# EAGLE design lvc-sampler (EAGLE 9.4.1)
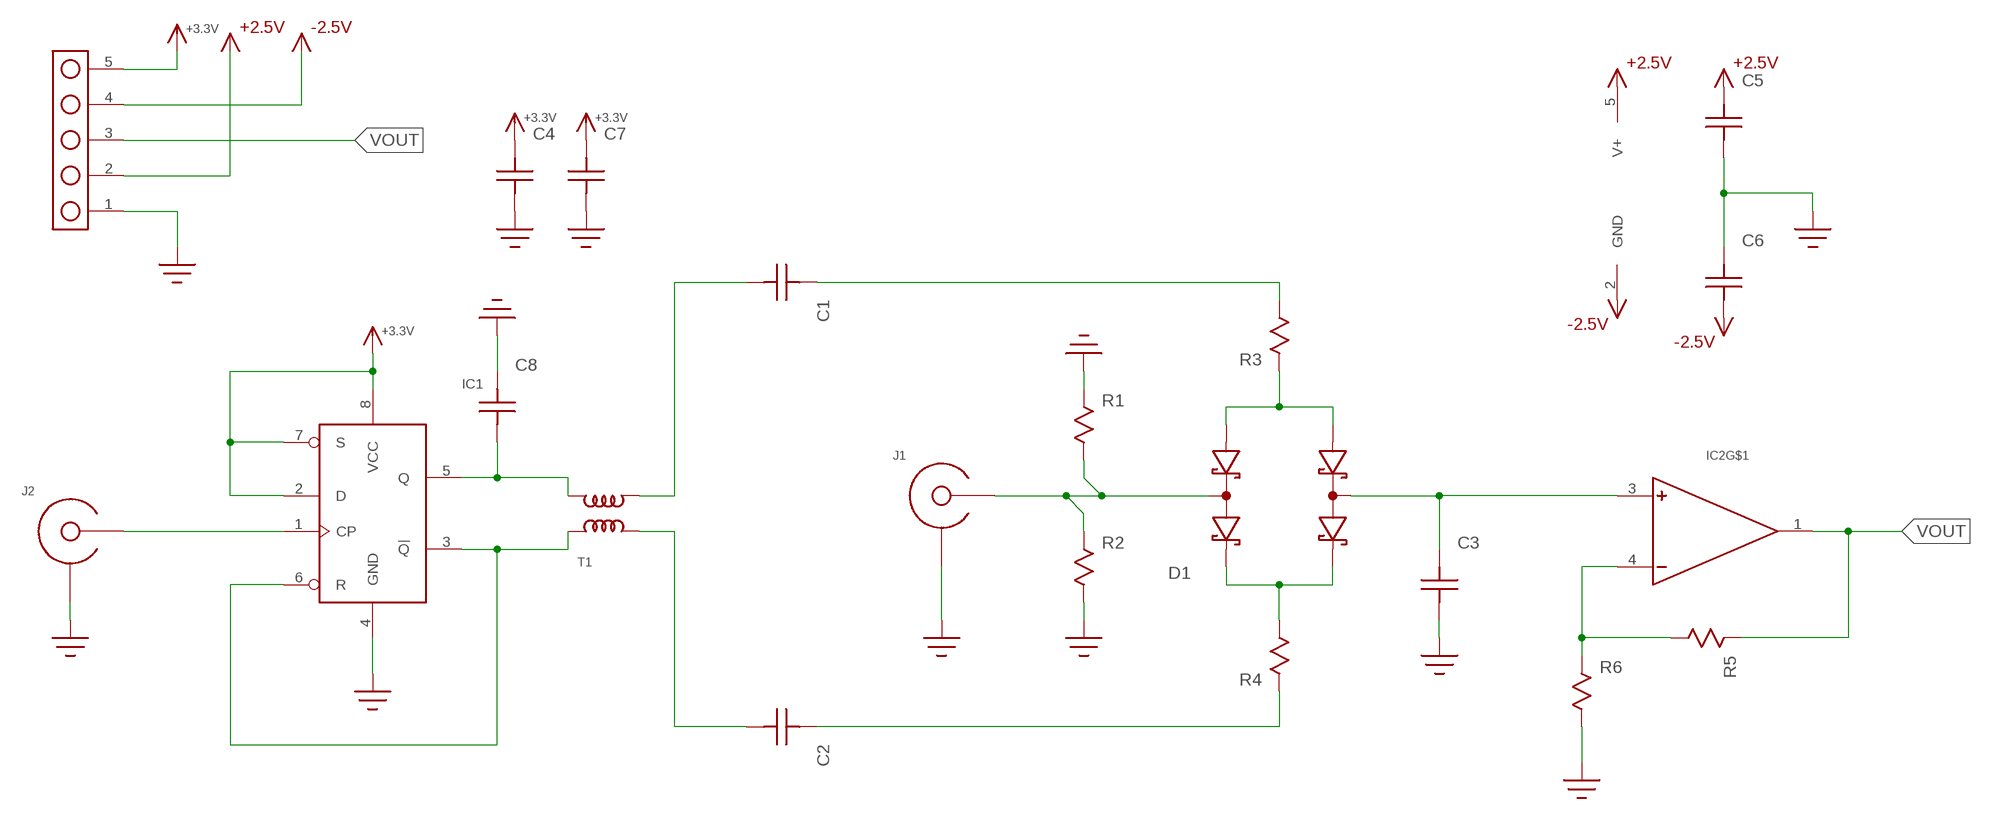
[diagram p0: schematic, sheet 1]

## Parts
C1  C0603  [C0603]
C2  C0603  [C0603]
C3  C0603  [C0603]
C4  C0603  [C0603]
C5  C0603  [C0603]
C6  C0603  [C0603]
C7  C0603  [C0603]
C8  C0603  [C0603]
D1  SMS3923-081  [SC-88]
IC1  74LVC2G74  [SSOP8]
IC2  MCP601  [SOT23-5]
J1  SMA-EDGE-LAUNCH4020_TAPER  [SMA_EDGE_LAUNCH_2L_4020_TAPER]
J2  SMA-EDGE-LAUNCH4020_TAPER  [SMA_EDGE_LAUNCH_2L_4020_TAPER]
J3  HEADER_5PIN  [HEADER_5PIN]
R1  R0603  [R0603]
R2  R0603  [R0603]
R3  R0603  [R0603]
R4  R0603  [R0603]
R5  R0603  [R0603]
R6  R0603  [R0603]
T1  MABA007159  [MABAES0061]

## Nets
+2.5V: C5.P$2 IC2.5(V+) J3.2
+3.3V: C4.P$2 C7.P$2 IC1.2(D) IC1.7(S) IC1.8(VCC) J3.5
-2.5V: C6.P$1 IC2.2(GND) J3.4
GND: C3.P$1 C4.P$1 C5.P$1 C6.P$2 C7.P$1 C8.P$2 IC1.4(GND) J1.BOTTOM_GND(SHIELD) J1.GND@1(SHIELD) J1.GND@2(SHIELD) J1.GND@3(SHIELD) J1.GND@4(SHIELD) J1.GND@5(SHIELD) J1.GND@6(SHIELD) J1.GND@7(SHIELD) J1.GND@8(SHIELD) J1.GND@14(SHIELD) J1.GND@15(SHIELD) J1.GND@16(SHIELD) J1.GND@17(SHIELD) J1.GND_PAD1(SHIELD) J1.GND_PAD2(SHIELD) J1.P$1(SHIELD) J1.P$2(SHIELD) J2.BOTTOM_GND(SHIELD) J2.GND@1(SHIELD) J2.GND@2(SHIELD) J2.GND@3(SHIELD) J2.GND@4(SHIELD) J2.GND@5(SHIELD) J2.GND@6(SHIELD) J2.GND@7(SHIELD) J2.GND@8(SHIELD) J2.GND@14(SHIELD) J2.GND@15(SHIELD) J2.GND@16(SHIELD) J2.GND@17(SHIELD) J2.GND_PAD1(SHIELD) J2.GND_PAD2(SHIELD) J2.P$1(SHIELD) J2.P$2(SHIELD) J3.1 R1.P$1 R2.P$2 R6.P$2
N$1: IC1.3(!Q!) IC1.6(R) T1.5
N$2: D1.2(COMMON0) J1.CENTER@1(CENTER) R1.P$2 R2.P$1
N$3: D1.1(ANODE0) D1.6(ANODE1) R3.P$1
N$4: D1.3(CATHODE0) D1.4(CATHODE1) R4.P$2
N$5: C1.P$2 R3.P$2
N$6: C2.P$2 R4.P$1
N$7: C1.P$1 T1.3
N$8: C2.P$1 T1.1
N$9: C8.P$1 IC1.5(Q) T1.4
N$10: IC1.1(CP) J2.CENTER@1(CENTER)
N$11: C3.P$2 D1.5(COMMON1) IC2.3(+)
N$12: IC2.4(-) R5.P$2 R6.P$1
VOUT: IC2.1(OUT) J3.3 R5.P$1

## Library data of the parts
C1-C8 = yapo:C
D1 = yapo:SMS3923-081
IC1 = yapo:74LVC2G74
IC2 = yapo:MCP601
J1 J2 = yapo:SMA-EDGE-LAUNCH
J3 = yapo:HEADER_5PIN
R1-R6 = yapo:R
T1 = yapo:MABA007159

## Board
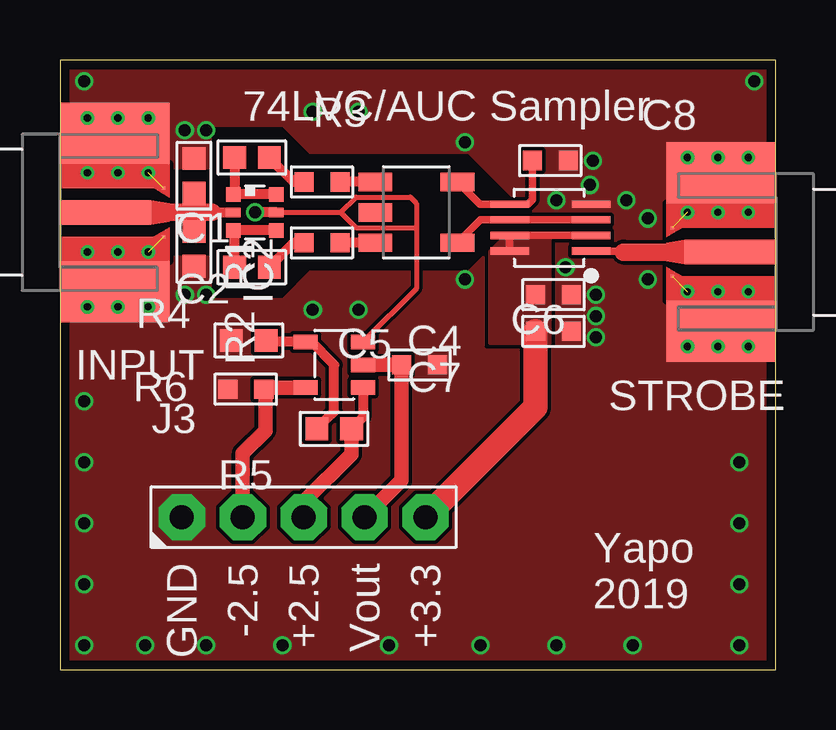
[diagram p1: board, top side]
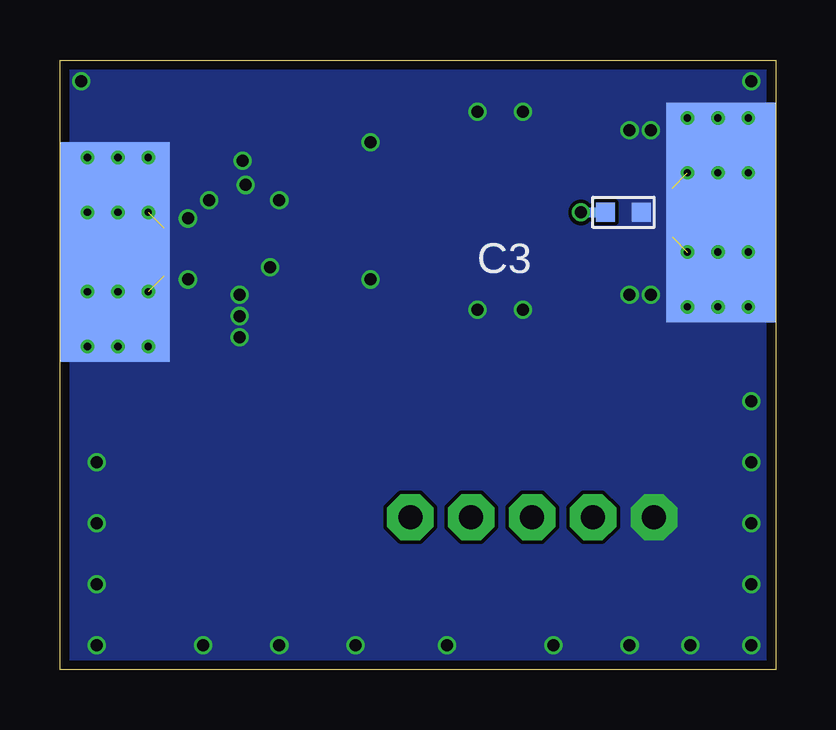
[diagram p2: board, bottom side, seen from below]

Size 29.84 x 25.4 mm. Coordinates in mm from the lower left corner, seen from the top.
Outline: 0,0 29.84,0 29.84,25.4 0,25.4 0,0
Copper layers (1*16): Top 0.035559375mm / dielectric 1.6mm / Bottom 0.035559375mm
Design rules "oshpark-2layer *": minimum track width 6mil, minimum drill 10mil, track to track 6mil, track to pad 6mil, pad to pad 6mil, via to via 6mil, smd to smd 6mil, copper to edge 15mil, drill to drill 6mil, minimum pad ring 5mil, minimum via ring 5mil, stop-mask expansion 2.5mil, vias tented up to drill 20mil, thermal gap 10mil

### Footprints (pad centres in the part's own frame; a part is rotated, then mirrored left to right if it is on the bottom)
C0603 = smd 0.8 x 0.8: P$1 -0.75,0; P$2 0.75,0
SC-88 = smd 0.6 x 0.6: 1 -0.9,0.75; 3 -0.9,-0.75; 4 0.9,-0.75; 6 0.9,0.75 | smd 0.6 x 0.4: 2 -0.9,0; 5 0.9,0
SSOP8 = smd 0.3 x 1.6: 1 -0.975,-1.7; 2 -0.325,-1.7; 3 0.325,-1.7; 4 0.975,-1.7; 5 0.975,1.7; 6 0.325,1.7; 7 -0.325,1.7; 8 -0.975,1.7
SOT23-5 = smd 0.6 x 1: 1 -0.95,-1.2; 2 0,-1.2; 3 0.95,-1.2; 4 0.95,1.2; 5 -0.95,1.2
SMA_EDGE_LAUNCH_2L_4020_TAPER = smd 4.572 x 9.144 bottom: BOTTOM_GND 2.286,0 | smd 3.81 x 1.016: CENTER@1 1.905,0 | drill 0.3: GND@1 1.143,3.937; GND@2 3.683,3.937; GND@3 1.143,1.651; GND@4 3.683,1.651; GND@5 1.143,-1.651; GND@6 3.683,-1.651; GND@7 1.143,-3.937; GND@8 3.683,-3.937; GND@14 2.413,3.937; GND@15 2.413,-3.937; GND@16 2.413,-1.651; GND@17 2.413,1.651 | smd 4.572 x 2.54: GND_PAD1 2.286,3.302; GND_PAD2 2.286,-3.302 | smd 0.127 x 0.127: P$1 4.318,1.016; P$2 4.318,-1.016
HEADER_5PIN = drill 1 pad 1.93 octagon: 1 -5.08,0; 2 -2.54,0; 3 0,0; 4 2.54,0; 5 5.08,0
R0603 = smd 0.95 x 0.95: P$1 -0.725,0; P$2 0.725,0
MABAES0061 = smd 0.76 x 1.4: 1 1.27,-1.715; 2 0,-1.715; 3 -1.27,-1.715; 4 -1.27,1.715; 5 1.27,1.715

### Placement (x,y rotation side)
C1  10.92,20.32 180 top
C2  10.92,17.78 180 top
C3  6.35,19.05 180 bottom
C4  20.57,15.62 180 top
C5  7.75,11.68 0 top
C6  14.99,12.7 0 top
C7  20.57,14.1 180 top
C8  20.45,21.21 0 top
D1  8.13,19.05 0 top
IC1  20.45,18.41 90 top
IC2  11.43,12.7 90 top
J1  0,19.05 0 top
J2  29.84,17.4 180 top
J3  10.16,6.35 0 top
R1  5.59,20.57 270 top
R2  5.59,17.53 270 top
R3  8,21.34 0 top
R4  8,16.76 180 top
R5  11.43,10.03 180 top
R6  7.87,13.72 180 top
T1  14.86,19.05 270 top

### Tracks (layer width: path | path; a pad name or v marks a point on that pad's centre or on a via)
+2.5V
  Top 0.61: IC2.5 8.56,11.75 | 8.56,11.75 C5.P$2 | J3.2 7.62,9.02 8.56,9.96 8.56,11.75
+3.3V
  Top 0.305: IC1.2 IC1.7 IC1.8
  Top 1.016: J3.5 19.82,10.93 C7.P$2
  pour Top (no thermals): 17.91,18.16 17.91,13.59 20.45,13.59 20.45,18.16
-2.5V
  Top 0.61: IC2.2 C6.P$1 14.24,7.89 J3.4
GND  (via drill 0.5)  (4 unrouted)
  other vias: 5.21,22.48 6.1,22.48 5.21,15.62 6.1,15.62 20.7,19.56 23.62,19.56 22.1,20.19 22.35,15.62 22.35,14.73 21.08,16.76 22.35,13.84 10.54,14.99 12.45,14.99 10.54,23.24 12.45,23.24 16.89,21.97 16.89,16.26 24.51,16.26 24.51,18.8 1.02,1.02 28.32,1.02 28.96,24.51 1.02,24.51 1.02,3.56 1.02,6.1 1.02,8.64 1.02,11.18 3.56,1.02 6.1,1.02 9.27,1.02 13.72,1.02 17.53,1.02 20.7,1.02 23.88,1.02 28.32,3.56 28.32,6.1 28.32,8.64 22.23,21.21
  pour Top (rank 2, no thermals): 0,0 0,25.4 29.84,25.4 29.84,0
  pour Bottom (no thermals): 0,0 0,25.4 29.84,25.4 29.84,0
  cutout Top (no thermals): 4.45,20.83 6.35,20.83 6.35,22.61 9.27,22.61 10.41,21.46 17.02,21.46 18.8,19.68 19.68,19.68 19.68,18.41 18.8,18.41 17.02,16.64 10.41,16.64 9.27,15.49 6.35,15.49 6.35,17.27 4.45,17.27
N$1
  Top 0.305: T1.5 17.53,18.74 IC1.6 IC1.3
N$2
  Top 0.406: 6.35,19.05 D1.2 | R1.P$2 5.71,19.72 5.71,19.05 5.59,18.92 R2.P$1
  Top 0.737: J1.CENTER@1 5.71,19.05 6.35,19.05
N$3
  Top 0.406: D1.6 D1.1 7.28,19.85 R3.P$1
N$4
  Top 0.406: D1.4 D1.3 7.28,18.25 R4.P$2
N$5
  Top 0.406: C1.P$2 9.74,20.32 R3.P$2
N$6
  Top 0.406: R4.P$1 9.74,17.78 C2.P$2
N$7
  Top 0.406: T1.3 C1.P$1
N$8
  Top 0.406: T1.1 C2.P$1
N$9
  Top 0.305: T1.4 17.5,19.39 IC1.5 19.52,19.39 19.7,19.57 C8.P$1
N$10
  Top 0.305: IC1.1 23.45,17.44 23.5,17.4
  Top 0.737: 23.5,17.4 J2.CENTER@1
N$11  (via drill 0.5)
  Top 0.203: D1.5 11.71,19.05 | 11.71,19.05 12.34,18.42 14.86,18.42 14.86,18.41 | 14.86,18.41 14.86,19.43 14.61,19.68 12.34,19.68 11.71,19.05 | 14.86,18.41 14.86,15.88 IC2.3
  Top 0.406: D1.5 v8.13,19.05
  Bottom 0.406: v8.13,19.05 C3.P$2
N$12
  Top 0.406: R5.P$2 11.32,10.65 11.43,10.76 11.43,12.7 10.48,13.65 IC2.4 8.66,13.65 R6.P$1
VOUT
  Top 0.406: IC2.1 12.63,10.51 R5.P$1
  Top 0.61: J3.3 10.16,6.99 12.15,8.98 R5.P$1

### Text on the board
tPlace: 74LVC/AUC Sampler | INPUT | STROBE | GND | -2.5 | +2.5 | Vout | +3.3 | Yapo | 2019